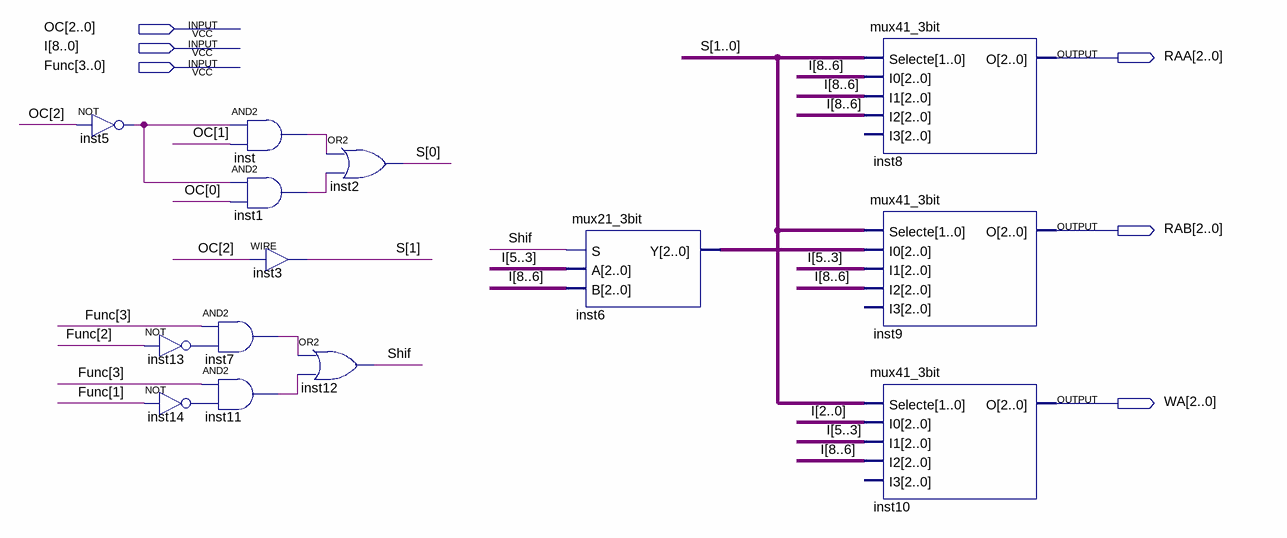
[diagram p0: schematic sheet]
// Quartus schematic Address_def.bdf as structural Verilog: 14 symbols, 6 pins
module Address_def (
  input  [2:0] OC,
  input  [8:0] I,
  input  [3:0] Func,
  output [2:0] RAA,
  output [2:0] RAB,
  output [2:0] WA
);

  wire inst1_out, inst5_out, inst7_out, inst11_out, inst13_out, inst14_out, inst_out, Shif;
  wire [1:0] S;
  wire [2:0] inst6_y;

  not inst5 (inst5_out, OC[2]);
  and inst7 (inst7_out, Func[3], inst13_out);
  not inst13 (inst13_out, Func[2]);
  and inst11 (inst11_out, Func[3], inst14_out);
  not inst14 (inst14_out, Func[1]);
  and inst (inst_out, inst5_out, OC[1]);
  and inst1 (inst1_out, inst5_out, OC[0]);
  assign S[1] = OC[2];  // WIRE inst3
  or inst2 (S[0], inst_out, inst1_out);
  or inst12 (Shif, inst7_out, inst11_out);
  mux21_3bit inst6 (.S(Shif), .A(I[5:3]), .B(I[8:6]), .Y(inst6_y));
  mux41_3bit inst8 (.Selecte(S), .I0(I[8:6]), .I1(I[8:6]), .I2(I[8:6]), .O(RAA));  // open: I3
  mux41_3bit inst9 (.Selecte(S), .I0(inst6_y), .I1(I[5:3]), .I2(I[8:6]), .O(RAB));  // open: I3
  mux41_3bit inst10 (.Selecte(S), .I0(I[2:0]), .I1(I[5:3]), .I2(I[8:6]), .O(WA));  // open: I3
endmodule
